# Altium schematic sheet index.SchDoc: template
size A4; Author: qitas; CompanyName: MCUYUN; DrawnBy: Hom; Engineer: Qitas; Organization: MCUYUN; Revision: A; SheetNumber: 1; SheetTotal: 1; Version: v0.1; LibVersion: v0.1
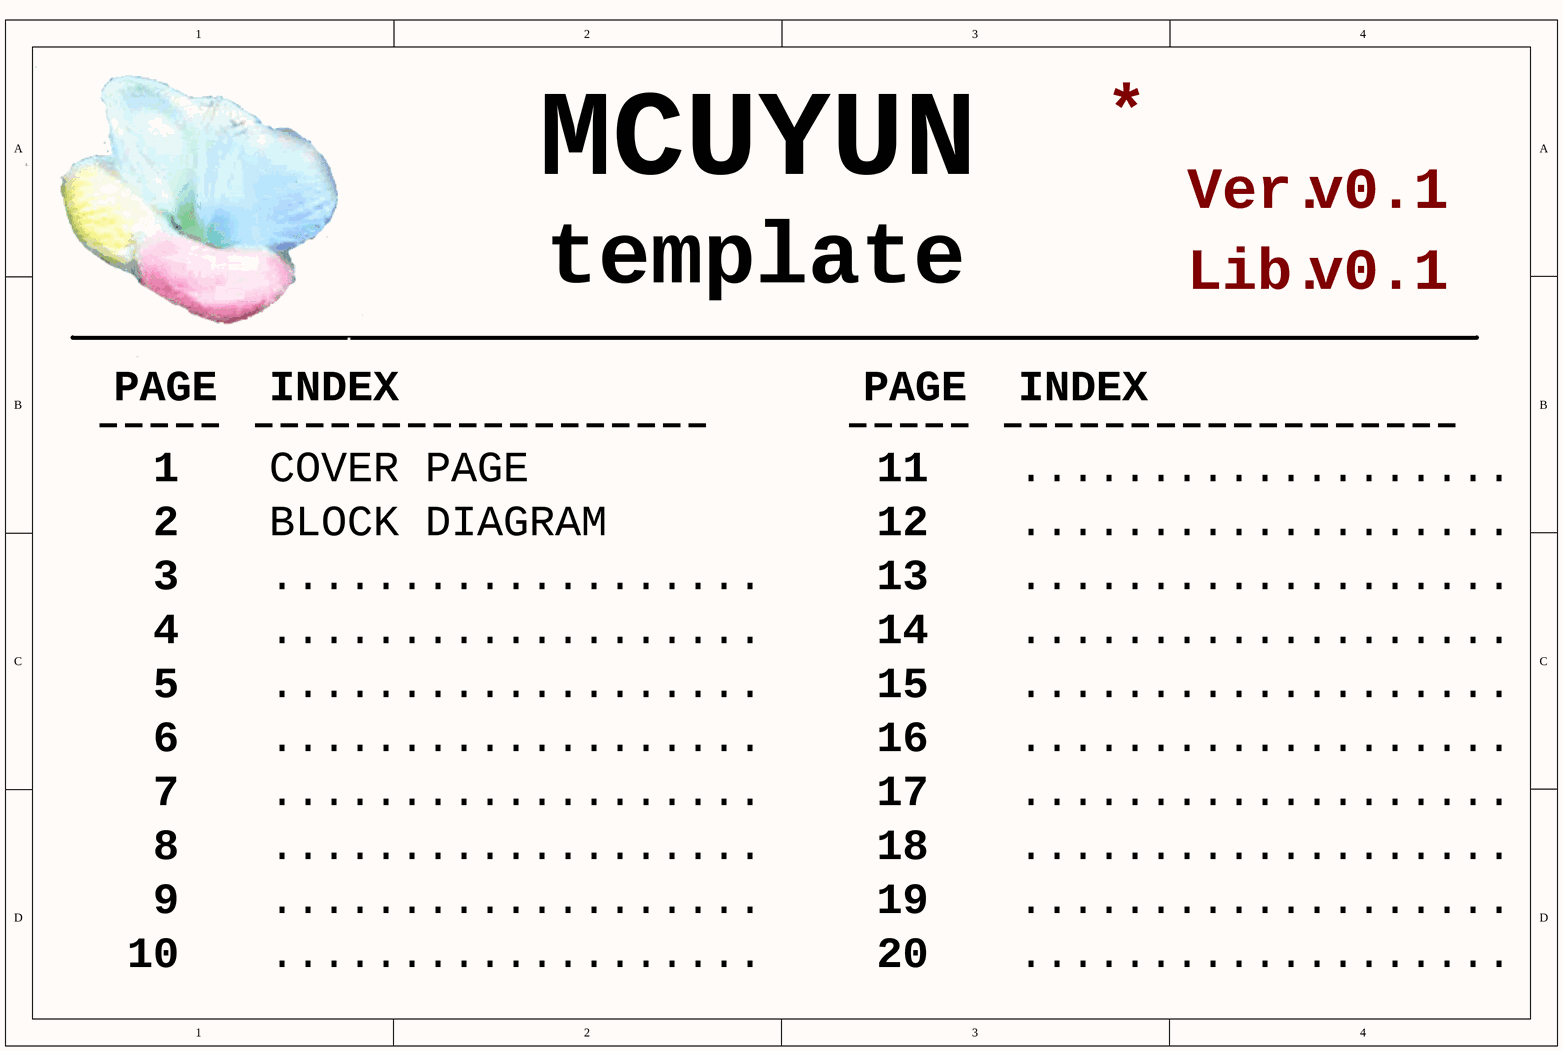
[diagram p0: index.SchDoc]

## Notes on the sheet
- Ver.
- Lib.
- PAGE
- INDEX
- 1
- COVER PAGE
- 11
- ...................
- 2
- 3
- BLOCK DIAGRAM
- 12
- 13
- 4
- 14
- 5
- 15
- 6
- 16
- 7
- 8
- 17
- 18
- 9
- 19
- 10
- 20